# EAGLE design PCRemoteControl (EAGLE 7.2.0)
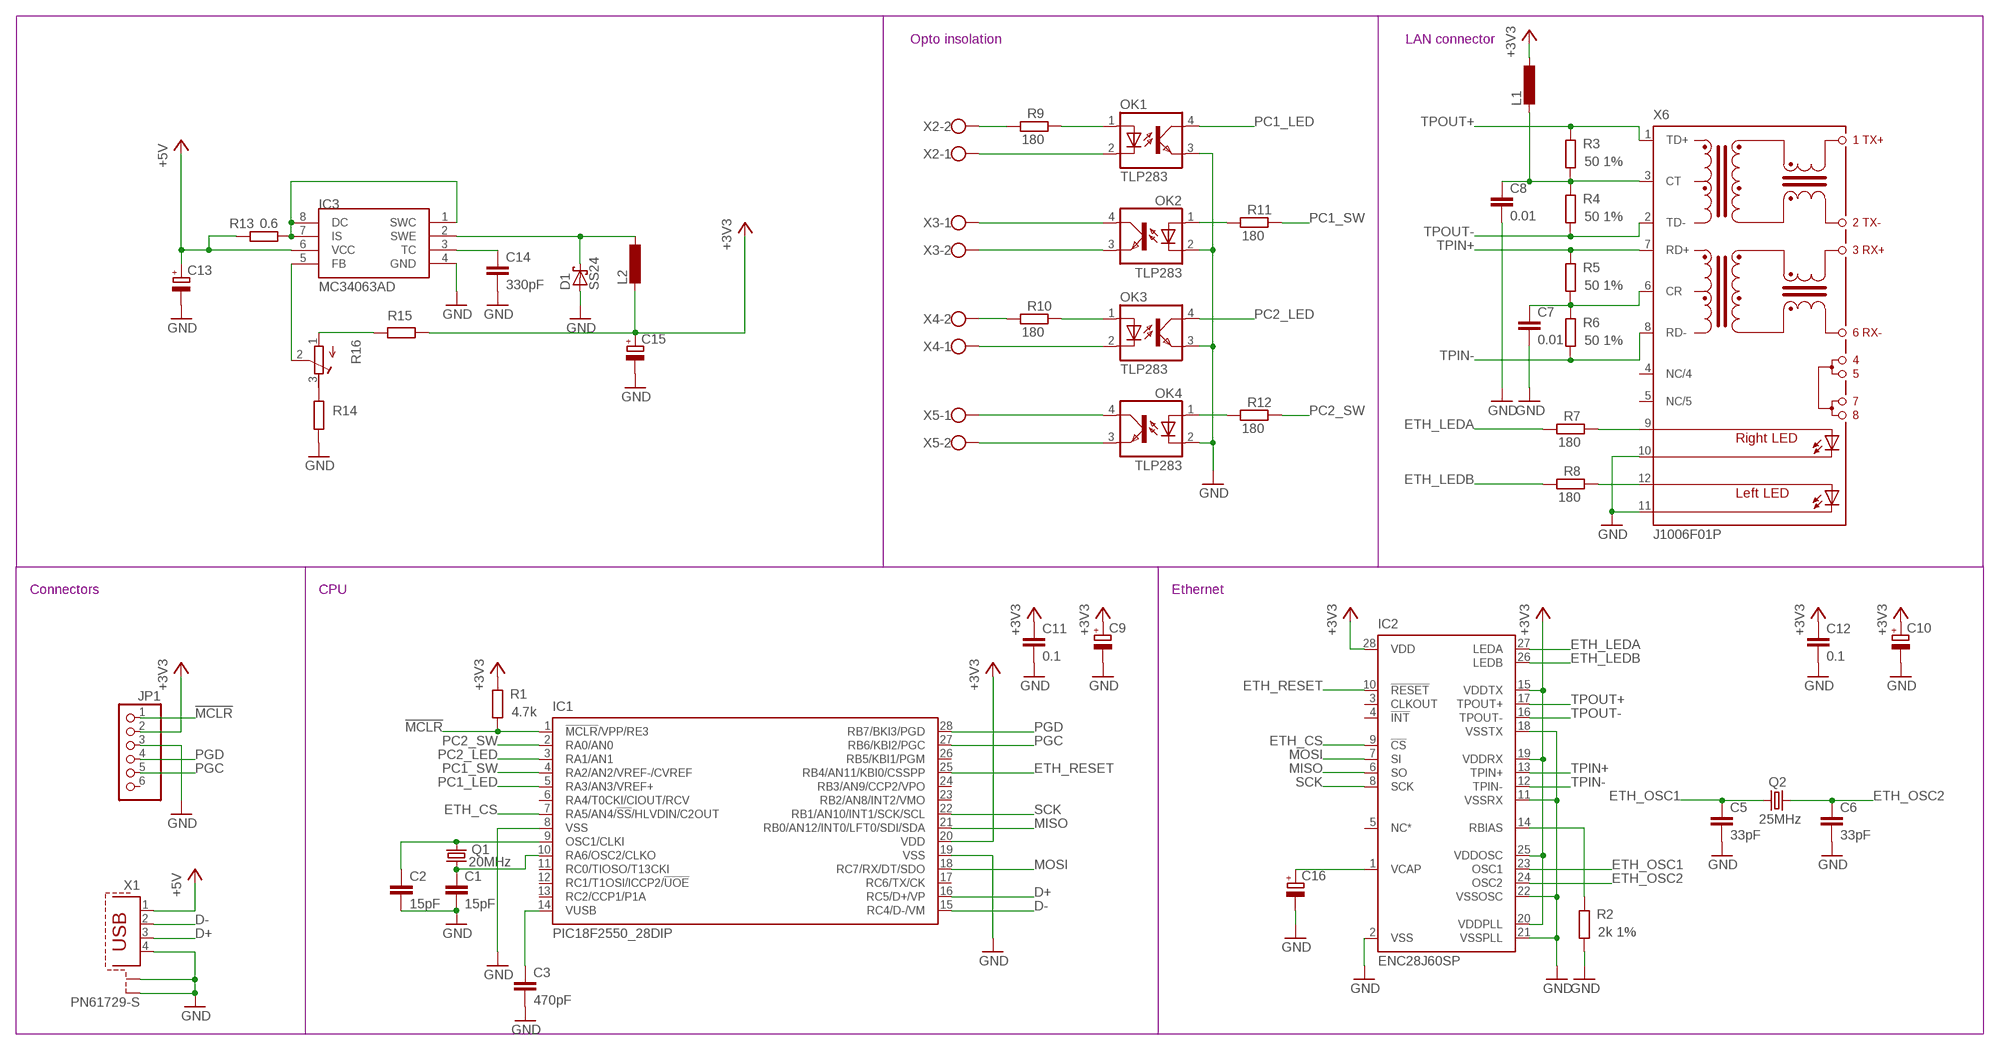
[diagram p0: schematic, sheet 1]

## Parts
C1  15pF  C-EUC1206  [C1206]
C2  15pF  C-EUC1206  [C1206]
C3  470pF  C-EUC1206  [C1206]
C5  33pF  C-EUC1206  [C1206]
C6  33pF  C-EUC1206  [C1206]
C7  0.01  C-EUC1206  [C1206]
C8  0.01  C-EUC1206  [C1206]
C9  CPOL-EUSMCD  [SMC_D]
C10  CPOL-EUSMCD  [SMC_D]
C11  0.1  C-EUC1206  [C1206]
C12  0.1  C-EUC1206  [C1206]
C13  CPOL-EUSMCD  [SMC_D]
C14  330pF  C-EUC1206  [C1206]
C15  CPOL-EUSMCD  [SMC_D]
C16  CPOL-EUSMCA  [SMC_A]
D1  SS24  SCHOTTKY-DIODESMD  [SMB]
IC1  PIC18F2550_28DIP  [DIL28-3]
IC2  ENC28J60SP  [DIL28-3]
IC3  MC34063AD  [SOIC8]
JP1  PINHD-1X6  [1X06]
L1  L-EUL3230M  [L3230M]
L2  L-EUPIS2816  [PIS2816]
OK1  TLP283  [MINI-FLAT-4]
OK2  TLP283  [MINI-FLAT-4]
OK3  TLP283  [MINI-FLAT-4]
OK4  TLP283  [MINI-FLAT-4]
Q1  20MHz  CRYSTALHC49S  [HC49/S]
Q2  25MHz  CRYSTALHC49S  [HC49/S]
R1  4.7k  R-EU_R1206  [R1206]
R2  2k 1%  R-EU_R1206  [R1206]
R3  50 1%  R-EU_R1206  [R1206]
R4  50 1%  R-EU_R1206  [R1206]
R5  50 1%  R-EU_R1206  [R1206]
R6  50 1%  R-EU_R1206  [R1206]
R7  180  R-EU_R1206  [R1206]
R8  180  R-EU_R1206  [R1206]
R9  180  R-EU_R1206  [R1206]
R10  180  R-EU_R1206  [R1206]
R11  180  R-EU_R1206  [R1206]
R12  180  R-EU_R1206  [R1206]
R13  0.6  R-EU_R1206  [R1206]
R14  R-EU_R1206  [R1206]
R15  R-EU_R1206  [R1206]
R16  R-TRIMM4G/J  [RTRIM4G/J]
X1  PN61729-S  [PN61729-S]
X2  W237-102  [W237-102]
X3  W237-102  [W237-102]
X4  W237-102  [W237-102]
X5  W237-102  [W237-102]
X6  J1006F01P  [J1]

## Nets
!MCLR!: IC1.1(!MCLR!/VPP/RE3) JP1.1 R1.1
+3V3: C9.+ C10.+ C11.1 C12.1 C15.+ IC1.20(VDD) IC2.15(VDDTX) IC2.19(VDDRX) IC2.20(VDDPLL) IC2.25(VDDOSC) IC2.28(VDD) JP1.2 L1.1 L2.2 R1.2 R15.1
+5V: C13.+ IC3.6(VCC) R13.2 X1.1
D+: IC1.16(RC5/D+/VP) X1.3
D-: IC1.15(RC4/D-/VM) X1.2
ETH_CS: IC1.7(RA5/AN4/!SS!/HLVDIN/C2OUT) IC2.9(!CS)
ETH_LEDA: IC2.27(LEDA) R7.2
ETH_LEDB: IC2.26(LEDB) R8.2
ETH_OSC1: C5.1 IC2.23(OSC1) Q2.1
ETH_OSC2: C6.1 IC2.24(OSC2) Q2.2
ETH_RESET: IC1.25(RB4/AN11/KBI0/CSSPP) IC2.10(!RESET)
GND: C1.2 C2.2 C3.2 C5.2 C6.2 C7.2 C8.2 C9.- C10.- C11.2 C12.2 C13.- C14.2 C15.- C16.- D1.A IC1.8(VSS) IC1.19(VSS) IC2.2(VSS) IC2.11(VSSRX) IC2.18(VSSTX) IC2.21(VSSPLL) IC2.22(VSSOSC) IC3.4(GND) JP1.3 OK1.3(EMIT) OK2.2(C) OK3.3(EMIT) OK4.2(C) R2.1 R14.1 X1.4 X1.S1 X1.S2 X6.10(C-R) X6.11(C-L)
MISO: IC1.21(RB0/AN12/INT0/LFT0/SDI/SDA) IC2.6(SO)
MOSI: IC1.18(RC7/RX/DT/SDO) IC2.7(SI)
N$1: C2.1 IC1.9(OSC1/CLKI) Q1.1
N$2: C1.1 IC1.10(RA6/OSC2/CLKO) Q1.2
N$3: C16.+ IC2.1(VCAP)
N$4: C3.1 IC1.14(VUSB)
N$5: IC2.14(RBIAS) R2.2
N$6: C8.1 L1.2 R3.1 R4.2 X6.3(CT)
N$7: C7.1 R5.1 R6.2 X6.6(CR)
N$8: R7.1 X6.9(A-R)
N$9: R8.1 X6.12(A-L)
N$10: R10.2 X4.2
N$11: OK1.1(A) R9.1
N$12: OK3.2(C) X4.1
N$13: OK1.2(C) X2.1
N$14: OK3.1(A) R10.1
N$15: R9.2 X2.2
N$16: OK2.4(COL) X3.1
N$17: OK2.3(EMIT) X3.2
N$18: OK4.4(COL) X5.1
N$19: OK4.3(EMIT) X5.2
N$20: OK2.1(A) R11.2
N$21: OK4.1(A) R12.2
N$22: R14.2 R16.3(E)
N$23: IC3.1(SWC) IC3.7(IS) IC3.8(DC) R13.1
N$24: C14.1 IC3.3(TC)
N$25: R15.2 R16.1(A)
N$26: D1.C IC3.2(SWE) L2.1
N$27: IC3.5(FB) R16.2(S)
PC1_LED: IC1.5(RA3/AN3/VREF+) OK1.4(COL)
PC1_SW: IC1.4(RA2/AN2/VREF-/CVREF) R11.1
PC2_LED: IC1.3(RA1/AN1) OK3.4(COL)
PC2_SW: IC1.2(RA0/AN0) R12.1
PGC: IC1.27(RB6/KBI2/PGC) JP1.5
PGD: IC1.28(RB7/BKI3/PGD) JP1.4
SCK: IC1.22(RB1/AN10/INT1/SCK/SCL) IC2.8(SCK)
TPIN+: IC2.13(TPIN+) R5.2 X6.7(RD+)
TPIN-: IC2.12(TPIN-) R6.1 X6.8(RD-)
TPOUT+: IC2.17(TPOUT+) R3.2 X6.1(TD+)
TPOUT-: IC2.16(TPOUT-) R4.1 X6.2(TD-)
Unconnected: IC1.6(RA4/T0CKI/CIOUT/RCV) IC1.11(RC0/TIOSO/T13CKI) IC1.12(RC1/T1OSI/ICCP2/!UOE) IC1.13(RC2/CCP1/P1A) IC1.17(RC6/TX/CK) IC1.23(RB2/AN8/INT2/VMO) IC1.24(RB3/AN9/CCP2/VPO) IC1.26(RB5/KBI1/PGM) IC2.3(CLKOUT) IC2.4(!INT) IC2.5(NC*) JP1.6 X6.4(NC/4) X6.5(NC/5)

## Notes on the sheet
- Opto insolation | LAN connector
- Connectors | CPU | Ethernet

## Library data of the parts
C1-C3 C5-C8 C11 C12 C14 = rcl:C-EU: CAPACITOR, European symbol
C9 C10 C13 C15 C16 = rcl:CPOL-EU: POLARIZED CAPACITOR, European symbol
D1 = diode:SCHOTTKY-DIODE: Schottky Diode
IC1 = microchip:PIC18F2*_28: USB Microcontrollers with nanoWatt Technology High-Performance, Enhanced Flash, 28/40/44-Pin, Source: http://ww1.microchip.com/downloads/en/devicedoc/39632c.pdf; MF: MICROCHIP; MPN: PIC18F2550-I/SP; OC_FARNELL: 1523822; OC_NEWARK: 80K6054
IC2 = microchip:ENC28J60: Stand-Alone Ethernet Controller with SPI Interface Source: http://ww1.microchip.com/downloads/en/DeviceDoc/39662c.pdf; MF: MICROCHIP; MPN: ENC28J60/SP; OC_FARNELL: 1084619; OC_NEWARK: 96K3661
IC3 = mc34063:MC34063
JP1 = adafruit:PINHD-1X6: PIN HEADER
L1 L2 = rcl:L-EU: INDUCTOR, European symbol
OK1-OK4 = optocoupler:TLP283: TOSHIBA PHOTOCOUPLER GaAs IRED & PHOTO-TRANSISTOR Source: http://www.semicon.toshiba.co.jp/td/en/Opto/Photocoupler/en_20050928_TLP283_datasheet.pdf; OC_FARNELL: unknown; OC_NEWARK: unknown
Q1 Q2 = adafruit:CRYSTAL: CRYSTAL; OC_FARNELL: 1667008; OC_NEWARK: unknown
R1-R15 = rcl:R-EU_: RESISTOR, European symbol
R16 = rcl:R-TRIMM: Trimm resistor
X1 = con-berg:PN61729-S: BERG USB connector; OC_FARNELL: unknown; OC_NEWARK: unknown
X2-X5 = con-wago-500:W237-102: WAGO SCREW CLAMP; MPN: 237-102; OC_FARNELL: unknown; OC_NEWARK: 70K9898
X6 = con-pulse:J1006F01P: PULSEJACK (TM) 1x1 Tab-UP RJ45 10/100 Base-TX RJ45 1x1 Tab-UP with LEDs 8-pin (J1 series) and 6-pin (JP series) integrated magnetics connector, designed to support applications, such as ADSL modems, LAN-on-Motherboard, and Hub and Switches. Source: www.pulseeng.com .. PulseJack-J402.pdf; OC_FARNELL: unknown; OC_NEWARK: unknown

## Board
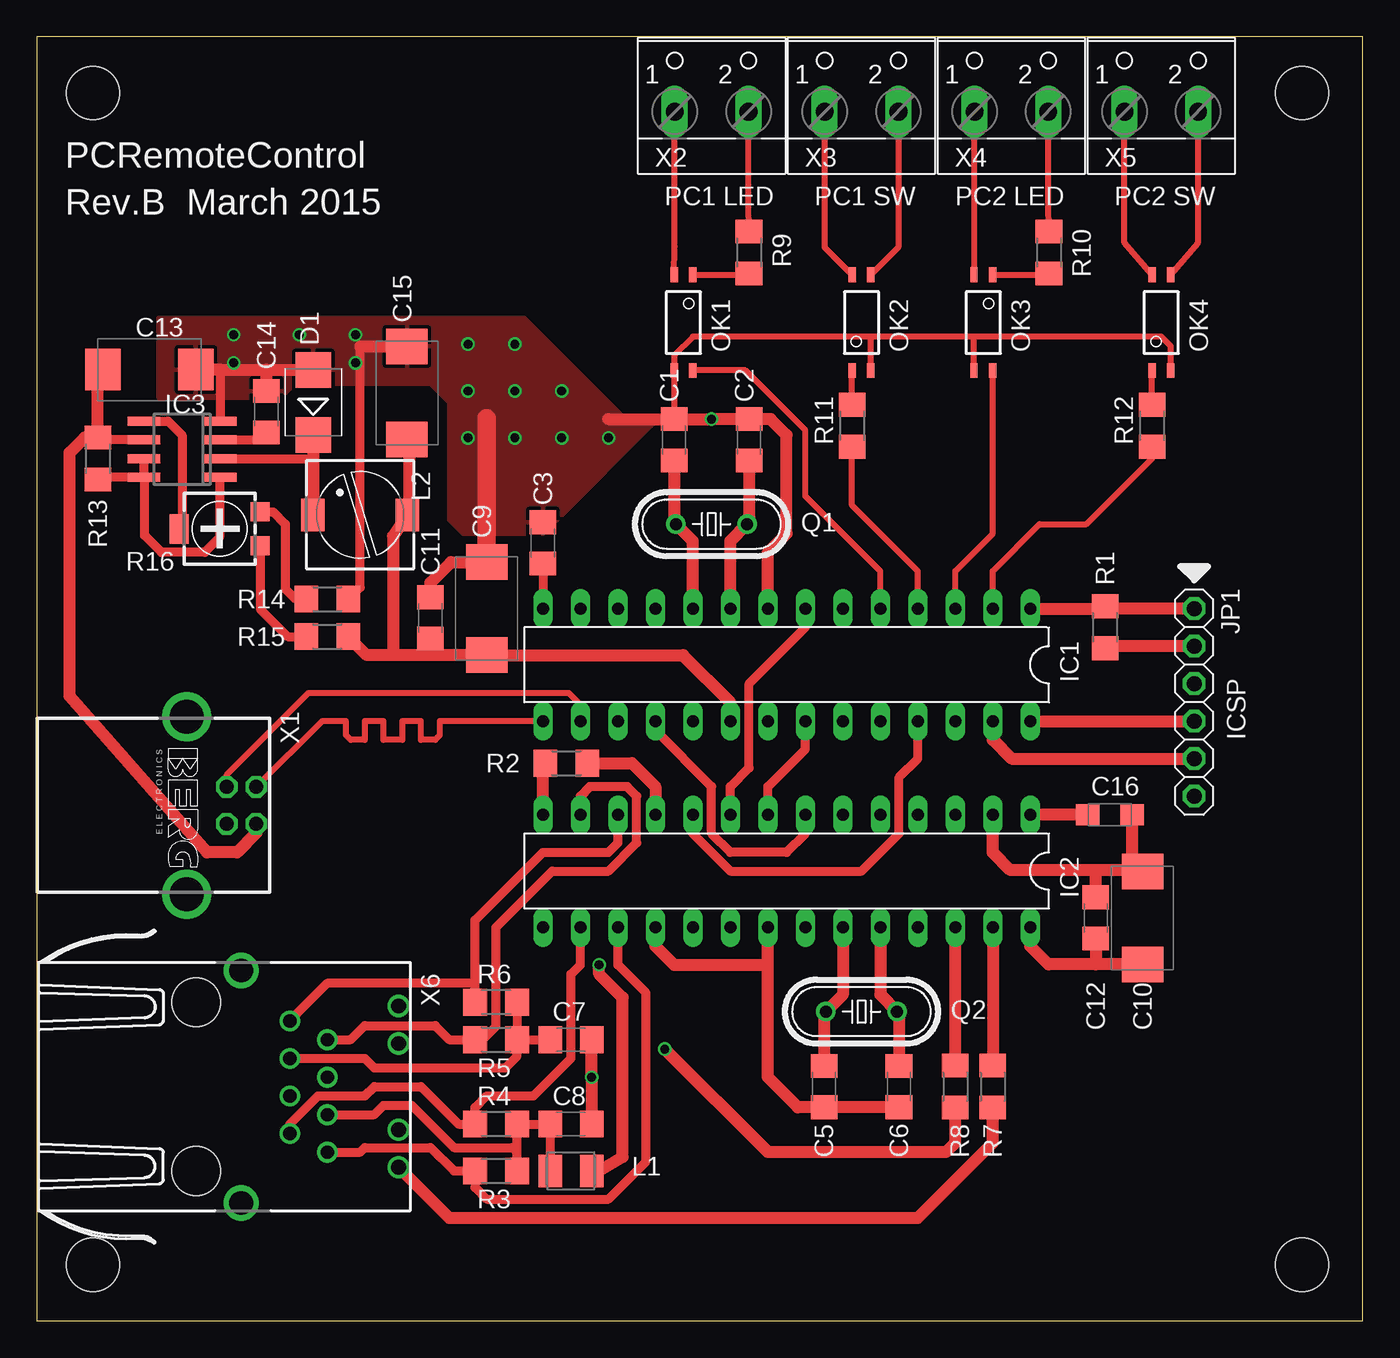
[diagram p1: board, top side]
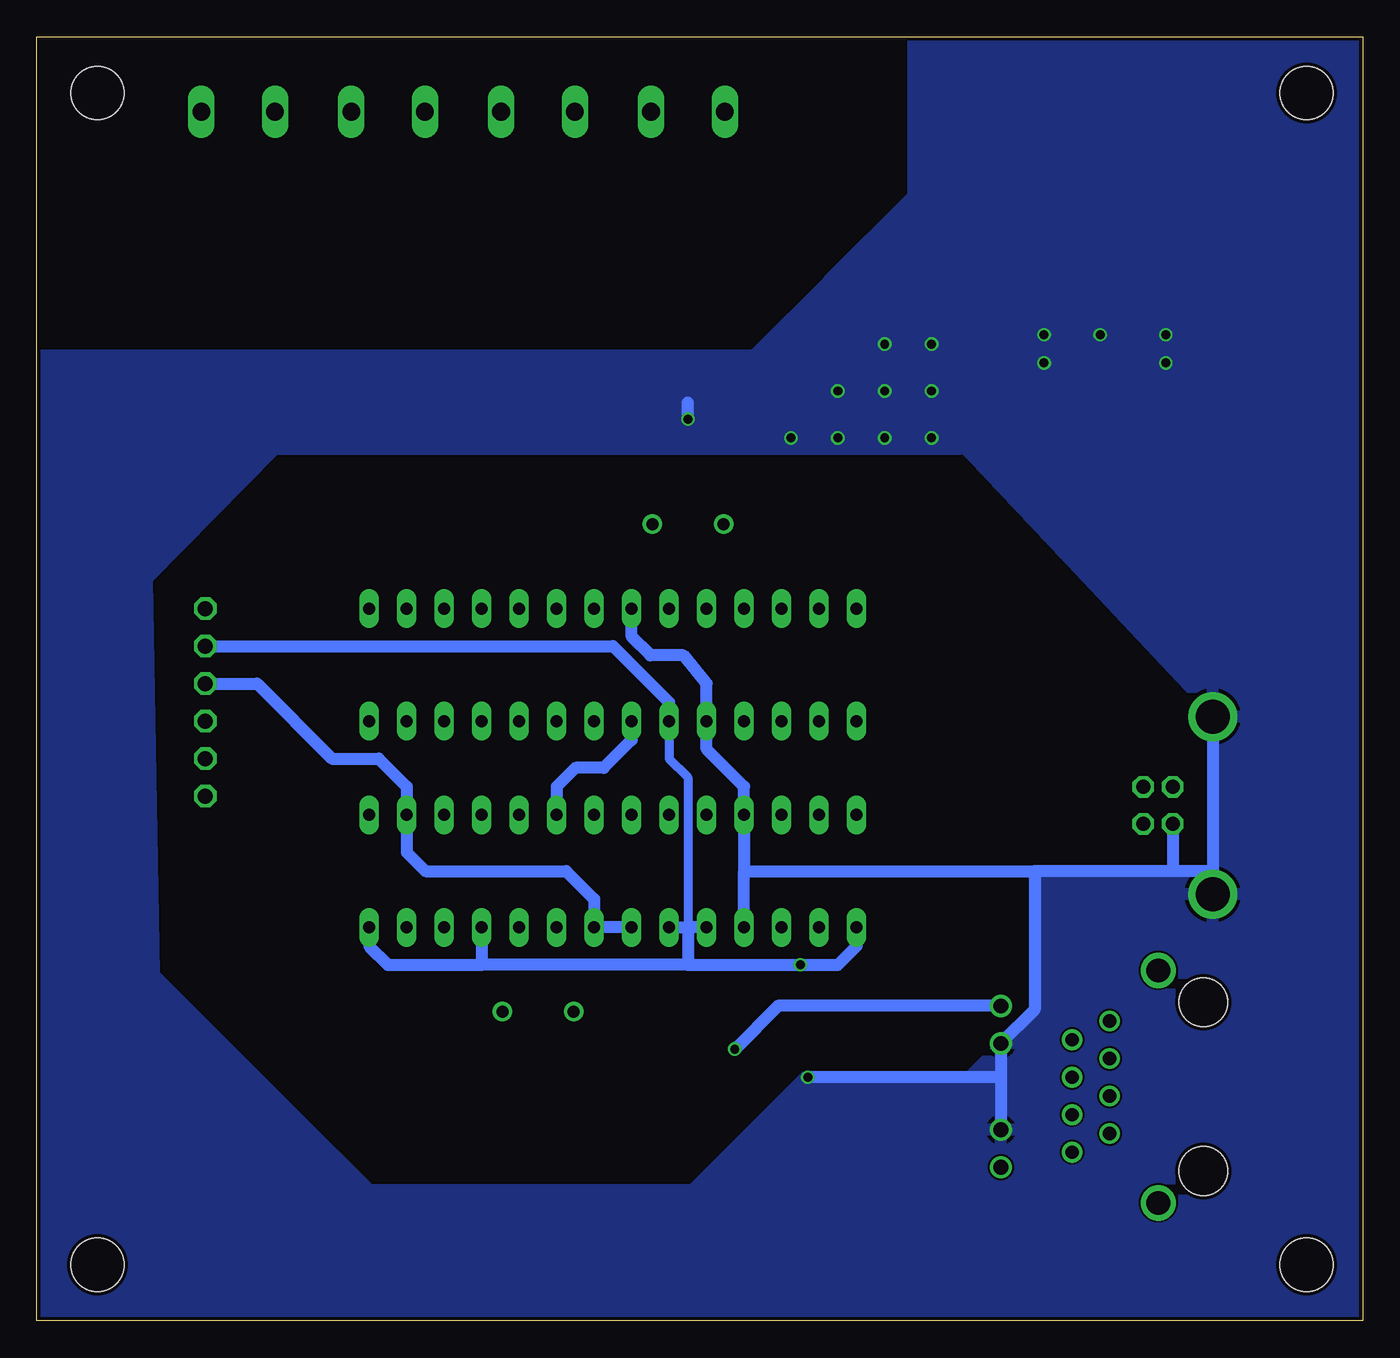
[diagram p2: board, bottom side, seen from below]

Size 89.84 x 86.98 mm. Coordinates in mm from the lower left corner, seen from the top.
Outline: 0,0 89.84,0 89.84,86.98 0,86.98 0,0
Copper layers (1*16): Top 0.035mm / dielectric 1.5mm / Bottom 0.035mm
Design rules "dirt_cheap_dirty_boards.v1": minimum track width 5mil, minimum drill 12mil, track to track 5mil, track to pad 5mil, pad to pad 5mil, via to via 5mil, smd to smd 0mil, copper to edge 10mil, drill to drill 10mil, minimum pad ring 10mil, minimum via ring 6mil, stop-mask expansion 2mil, vias tented up to drill 25mil, thermal gap 10mil
Holes 3.6 mm at 3.81,83.19 3.81,3.81 85.72,3.81 85.72,83.19

### Footprints (pad centres in the part's own frame; a part is rotated, then mirrored left to right if it is on the bottom)
C1206 = smd 1.6 x 1.8: 1 -1.4,0; 2 1.4,0
SMC_D = smd 2.4 x 2.8: + -3.15,0; - 3.15,0
SMC_A = smd 1.6 x 1.4: + -1.5,0; - 1.5,0
SMB = smd 2.4 x 2.4: A 2.2,0; C -2.2,0
DIL28-3 = drill 0.813 long: 1 -16.51,-3.81; 2 -13.97,-3.81; 3 -11.43,-3.81; 4 -8.89,-3.81; 5 -6.35,-3.81; 6 -3.81,-3.81; 7 -1.27,-3.81; 8 1.27,-3.81; 9 3.81,-3.81; 10 6.35,-3.81; 11 8.89,-3.81; 12 11.43,-3.81; 13 13.97,-3.81; 14 16.51,-3.81; 15 16.51,3.81; 16 13.97,3.81; 17 11.43,3.81; 18 8.89,3.81; 19 6.35,3.81; 20 3.81,3.81; 21 1.27,3.81; 22 -1.27,3.81; 23 -3.81,3.81; 24 -6.35,3.81; 25 -8.89,3.81; 26 -11.43,3.81; 27 -13.97,3.81; 28 -16.51,3.81
SOIC8 = smd 0.6 x 2.2: 1 -1.905,-2.6; 2 -0.635,-2.6; 3 0.635,-2.6; 4 1.905,-2.6; 5 1.905,2.6; 6 0.635,2.6; 7 -0.635,2.6; 8 -1.905,2.6
1X06 = drill 1.016 octagon: 1 -6.35,0; 2 -3.81,0; 3 -1.27,0; 4 1.27,0; 5 3.81,0; 6 6.35,0
L3230M = smd 1.6 x 2.2: 1 -1.4,0; 2 1.4,0
PIS2816 = smd 2.2 x 1.6: 1 0,3.2; 2 0,-3.2
MINI-FLAT-4 = smd 1 x 0.5: 1 -3.24,0.635; 2 -3.24,-0.635; 3 3.24,-0.635; 4 3.24,0.635
HC49/S = drill 0.813: 1 -2.413,0; 2 2.413,0
R1206 = smd 1.6 x 1.803: 1 -1.422,0; 2 1.422,0
RTRIM4G/J = smd 1.3 x 1.3: 1 -1.15,-2.75; 3 1.15,-2.75 | smd 2 x 1.3: 2 0,2.75
PN61729-S = drill 0.95 octagon: 1 1.25,4.71; 2 -1.25,4.71; 3 -1.25,2.71; 4 1.25,2.71 | drill 2.3 pad 2.9: S1 -6.02,0; S2 6.02,0
W237-102 = drill 1.194 long: 1 -2.5,-1.27; 2 2.5,-1.27
J1 = drill 0.9 pad 1.3: 1 4.445,2.54; 2 3.175,0; 3 1.905,2.54; 4 0.635,0; 5 -0.635,2.54; 6 -1.905,0; 7 -3.175,2.54; 8 -4.445,0 | drill 1 pad 1.422: 9 5.465,7.37; 10 2.925,7.37; 11 -2.925,7.37; 12 -5.465,7.37 | drill 1.6 pad 2.184: M1 -7.875,-3.3; M2 7.875,-3.3 | hole 3.3: 5.715,-6.35; -5.715,-6.35

### Placement (x,y rotation side)
C1  43.18,59.69 90 top
C2  48.26,59.69 90 top
C3  34.29,52.7 90 top
C5  53.34,15.88 270 top
C6  58.42,15.88 270 top
C7  36.2,19.05 0 top
C8  36.2,13.33 0 top
C9  30.48,48.26 90 top
C10  74.93,27.3 90 top
C11  26.67,47.62 90 top
C12  71.75,27.3 90 top
C13  7.62,64.45 0 top
C14  15.56,61.59 90 top
C15  25.08,62.87 90 top
C16  72.71,34.29 0 top
D1  18.73,62.23 90 top
IC1  50.8,44.45 180 top
IC2  50.8,30.48 180 top
IC3  9.84,59.05 90 top
JP1  78.42,41.91 270 top
L1  36.2,10.16 180 top
L2  21.91,54.61 90 top
OK1  43.81,67.63 270 top
OK2  55.88,67.63 90 top
OK3  64.14,67.63 270 top
OK4  76.2,67.63 90 top
Q1  45.72,53.98 180 top
Q2  55.88,20.96 0 top
R1  72.39,46.99 270 top
R2  35.88,37.78 180 top
R3  31.11,10.16 180 top
R4  31.11,13.33 0 top
R5  31.11,19.05 180 top
R6  31.11,21.59 0 top
R7  64.77,15.88 90 top
R8  62.23,15.88 90 top
R9  48.26,72.39 90 top
R10  68.58,72.39 90 top
R11  55.24,60.64 90 top
R12  75.56,60.64 90 top
R13  4.13,58.42 90 top
R14  19.68,48.9 180 top
R15  19.68,46.36 180 top
R16  12.38,53.66 90 top
X1  10.16,34.93 270 top
X2  45.72,83.19 0 top
X3  55.88,83.19 0 top
X4  66.04,83.19 0 top
X5  76.2,83.19 0 top
X6  17.14,15.88 270 top

### Tracks (layer width: path | path; a pad name or v marks a point on that pad's centre or on a via)
!MCLR!
  Top 0.813: JP1.1 72.54,48.26 R1.1 72.24,48.26 IC1.1
+3V3  (via drill 0.6)
  Top 0.61: C15.+ 25.23,59.57 | L1.1 38.1,10.16
  Top 0.813: JP1.2 72.54,45.72 R1.2 | C10.+ 71.75,24.16 | 71.75,24.16 68.56,24.16 67.31,25.4 IC2.28 | C12.1 71.75,24.16 | IC1.20 46.99,41.91 43.79,45.11 C9.+ 26.67,45.11 | 26.67,45.11 24.13,45.11 | 24.13,45.11 22.35,45.11 R15.1 | C11.1 26.67,45.11 | 24.13,45.11 24.13,53.17 L2.2 25.23,54.61 25.23,59.57 | 38.1,10.16 39.69,11.11 39.69,21.91 38.1,23.5 v38.1,24.13
  Bottom 0.61: IC1.20 46.99,38.1 45.72,36.83 45.72,26.67
  Bottom 0.813: IC2.20 45.72,26.67 | IC2.15 34.29,25.4 35.56,24.13 v38.1,24.13 45.72,24.13 | 45.72,24.13 59.69,24.13 | IC2.28 67.31,25.4 66.04,24.13 59.69,24.13 | IC2.25 59.69,24.13 | JP1.2 50.8,45.72 46.99,41.91 IC1.20 | IC2.19 45.72,26.67 | 45.72,26.67 45.72,24.13
+5V
  Top 0.61: IC3.6 4.28,59.69 R13.2 | 4.13,63.79 C13.+
  Top 0.813: 4.13,63.79 R13.2 3.23,59.84 2.22,58.83 2.22,42.32 11.53,31.75 13.56,31.75 14.87,33.06 X1.1
D+
  Top 0.406: X1.3 12.87,37 18.41,42.55 36.04,42.55 36.83,41.75 IC1.16
D-
  Top 0.406: IC1.15 27.3,40.64 27.3,39.69 26.99,39.37 26.04,39.37 26.04,40.64 24.77,40.64 24.77,39.37 23.5,39.37 23.5,40.64 22.23,40.64 22.23,39.37 21.27,39.37 20.95,39.69 20.95,40.64 19.34,40.64 X1.2
ETH_CS
  Top 0.61: IC2.9 46.99,36.2 48.26,37.47 48.26,43.18 52.07,46.99 IC1.7
ETH_LEDA
  Top 0.813: IC2.27 R7.2
ETH_LEDB
  Top 0.813: R8.2 IC2.26
ETH_OSC1
  Top 0.813: IC2.23 54.61,22.1 Q2.1 53.34,20.83 C5.1
ETH_OSC2
  Top 0.813: IC2.24 57.15,22.1 Q2.2 58.42,20.83 C6.1
ETH_RESET
  Top 0.61: IC2.10 44.45,33.02 46.99,30.48 55.88,30.48 58.42,33.02 58.42,36.83 59.69,38.1 IC1.25
GND  (via drill 0.6, 0.6 pad 0.81)
  Top 0.406: OK4.2 76.83,66.04 76.2,66.67 63.5,66.67 | 63.5,66.67 56.52,66.67 | 56.52,66.67 44.45,66.67 43.18,65.41 OK1.3 C1.2 | OK2.2 56.52,66.67 | OK3.3 63.5,66.67
  Top 0.61: 18.44,64.45 D1.A | R14.1 21.91,49.7 21.91,66.02 | 25.61,66.02 C15.- | C3.2 34.29,53.98 | IC3.4 12.44,64.45
  Top 0.813: 74.21,30.54 71.75,30.54 | 71.75,30.54 65.98,30.54 64.77,31.75 IC2.2 | C12.2 71.75,30.54 | C16.- 74.21,30.54 | 74.21,30.54 C10.- | IC1.8 49.53,52.07 50.8,53.34 50.8,60.01 49.72,61.09 C2.2 v45.72,61.09 C1.2 38.73,61.09 | C6.2 C5.2 51.56,14.47 49.53,16.51 49.53,24.13 | R2.1 40.32,37.78 41.91,36.2 IC2.11 | 15.56,64.45 12.44,64.45 C13.- | 15.56,64.45 18.44,64.45 | C14.2 15.56,64.45 | 21.91,66.02 C15.- | C11.2 26.67,50.01 28.07,51.41 C9.- | 49.53,24.13 IC2.21 | C8.2 v37.59,16.51 C7.2 | IC2.18 41.91,25.4 43.18,24.13 49.53,24.13
  Top 1.27: C9.- 30.48,61.14
  Bottom 0.813: IC2.21 IC2.22 52.07,28.58 53.98,30.48 63.5,30.48 64.77,31.75 IC2.2 64.77,36.2 66.67,38.1 69.85,38.1 74.93,43.18 JP1.3 | IC1.8 49.53,46.36 48.26,45.09 46.04,45.09 44.45,43.18 IC1.19 44.45,38.73 41.91,36.2 IC2.11 41.91,30.48 | X6.11 X6.10 | X6.11 24.52,16.51 v37.59,16.51 | IC2.18 41.91,30.48 | 41.91,30.48 22.23,30.48 | 22.23,30.48 22.23,21.09 X6.11 | 10.16,30.48 12.87,30.48 | 12.87,30.48 22.23,30.48 | X1.4 12.87,30.48 | X1.S1 10.16,30.48 | 10.16,30.48 X1.S2 | v45.72,61.09 45.72,62.23
  other vias: 38.73,59.82 35.56,59.82 32.38,59.82 29.21,59.82 29.21,63 32.38,63 35.56,63 32.38,66.17 29.21,66.17 21.59,66.81 13.34,66.81 13.34,64.9 21.59,64.9 17.78,66.81
  pour Bottom: 0,0 89.53,0 89.53,65.41 41.21,65.47 36.2,70.43 36.2,70.48 30.48,76.2 30.48,66.04 27.3,66.04 27.3,59.05 73.76,59.05 82.39,50.26 81.92,23.5 67.31,8.89 45.4,8.89 37.78,16.51 26.67,16.51 22.23,20.96 22.23,30.48 0,30.48
  pour Bottom: 0,1.91 0,87 30.48,87 30.48,62.87 10.16,41.27 10.16,1.91
  pour Top: 8.26,62.55 8.26,67.95 33.02,67.95 39.69,61.28 43.18,61.28 43.18,60.96 41.91,60.96 34.29,53.34 28.89,53.34 27.94,54.29 27.94,62.23 26.67,63.5 17.46,63.5 16.51,62.55
MISO
  Bottom 0.813: IC1.21 49.53,39.37 51.44,37.47 53.34,37.47 54.61,36.2 IC2.6
MOSI
  Top 0.61: IC2.7 52.07,33.02 50.8,31.75 46.99,31.75 45.72,33.02 45.72,36.2 41.91,40.01 IC1.18
N$1
  Top 0.813: IC1.9 46.99,52.83 Q1.1 48.26,54.1 C2.1
N$2
  Top 0.813: IC1.10 44.45,52.83 Q1.2 43.18,54.1 C1.1
N$3
  Top 0.813: C16.+ IC2.1
N$4
  Top 0.61: C3.1 IC1.14
N$5
  Top 0.813: IC2.14 34.29,37.47 R2.2
N$6
  Top 0.61: R3.1 32.54,11.43 | 32.54,11.43 R4.2 C8.1 L1.2 | X6.3 22.86,13.97 23.5,14.6 25.4,14.6 28.26,11.75 32.22,11.75 32.54,11.43
N$7
  Top 0.61: R6.2 R5.1 | R5.1 C7.1 | X6.6 22.23,17.78 22.86,17.14 31.75,17.14 32.54,17.93 R5.1
N$8
  Top 0.813: X6.9 27.94,6.99 59.69,6.99 64.77,12.06 R7.1
N$9  (via drill 0.6)
  Top 0.813: R8.1 62.23,12.06 61.59,11.43 49.53,11.43 v42.55,18.42
  Bottom 0.813: X6.12 39.62,21.34 v42.55,18.42
N$10
  Top 0.406: R10.2 68.54,75.72 X4.2
N$11
  Top 0.406: OK1.1 48.26,70.87 R9.1
N$12
  Top 0.406: X4.1 63.5,81.92 OK3.2
N$13
  Top 0.406: OK1.2 43.22,72.77 X2.1
N$14
  Top 0.406: OK3.1 68.58,70.87 R10.1
N$15
  Top 0.406: R9.2 48.22,75.72 X2.2
N$16
  Top 0.406: X3.1 53.38,72.73 OK2.4
N$17
  Top 0.406: X3.2 58.38,72.73 OK2.3
N$18
  Top 0.406: OK4.4 73.7,73.05 X5.1
N$19
  Top 0.406: OK4.3 78.7,73.05 X5.2
N$20
  Top 0.406: R11.2 OK2.1
N$21
  Top 0.406: R12.2 OK4.1
N$22
  Top 0.61: R16.3 15.99,54.81 16.83,53.98 16.83,49.61 17.54,48.9 R14.2
N$23
  Top 0.61: IC3.8 4.28,57.15 R13.1 | IC3.7 IC3.8 | IC3.8 7.3,56.77 7.3,53.22 8.45,52.07 11.38,52.07 12.38,53.07 12.38,57.09 IC3.1
N$24
  Top 0.61: IC3.3 15.05,59.69 C14.1
N$25
  Top 0.61: R16.1 15.13,48.23 17.01,46.36 R15.2
N$26
  Top 0.61: IC3.2 18.73,58.42 | 18.73,54.76 L2.1
  Top 0.813: D1.C 18.73,58.42 18.73,54.76
N$27
  Top 0.61: IC3.5 8.89,60.96 9.84,60.01 9.84,54.08 R16.2
PC1_LED
  Top 0.406: IC1.5 57.15,50.8 52.07,55.88 52.07,60.33 48.01,64.39 OK1.4
PC1_SW
  Top 0.406: IC1.4 59.69,50.8 55.24,55.25 R11.1
PC2_LED
  Top 0.406: IC1.3 62.23,50.8 64.77,53.34 OK3.4
PC2_SW
  Top 0.406: IC1.2 64.77,50.8 67.94,53.98 71.12,53.98 75.56,58.42 R12.1
PGC
  Top 0.813: IC1.27 64.77,39.37 66.04,38.1 JP1.5
PGD
  Top 0.813: IC1.28 JP1.4
SCK
  Top 0.61: IC2.8 49.53,36.2 52.07,38.73 IC1.22
TPIN+
  Top 0.61: X6.7 21.27,19.05 22.23,20 26.99,20 27.94,19.05 R5.2 30.22,19.05 31.11,19.95 31.11,26.67 34.92,30.48 38.73,30.48 40.64,32.38 40.64,35.56 40.01,36.2 37.47,36.2 36.83,35.56 IC2.13
TPIN-
  Top 0.61: 29.69,22.86 19.68,22.86 X6.8 | R6.1 29.69,22.86 | 29.69,22.86 29.69,27.15 34.29,31.75 38.73,31.75 39.37,32.38 IC2.12
TPOUT+
  Top 0.61: X6.1 21.91,11.43 22.23,11.75 26.67,11.75 28.26,10.16 R3.2 29.69,9.04 30.48,8.25 38.73,8.25 41.27,10.79 41.27,22.23 39.37,24.13 IC2.17
TPOUT-
  Top 0.61: IC2.16 36.83,24.13 36.2,23.5 36.2,17.78 33.66,15.24 30.48,15.24 29.69,14.45 R4.1 28.57,13.33 26.04,15.88 22.86,15.88 22.23,15.24 19.05,15.24 17.14,13.33 X6.2

### Text on the board
tNames: PCRemoteControl | PC1 LED | PC1 SW | PC2 LED | PC2 SW | Rev.B March 2015 | ICSP